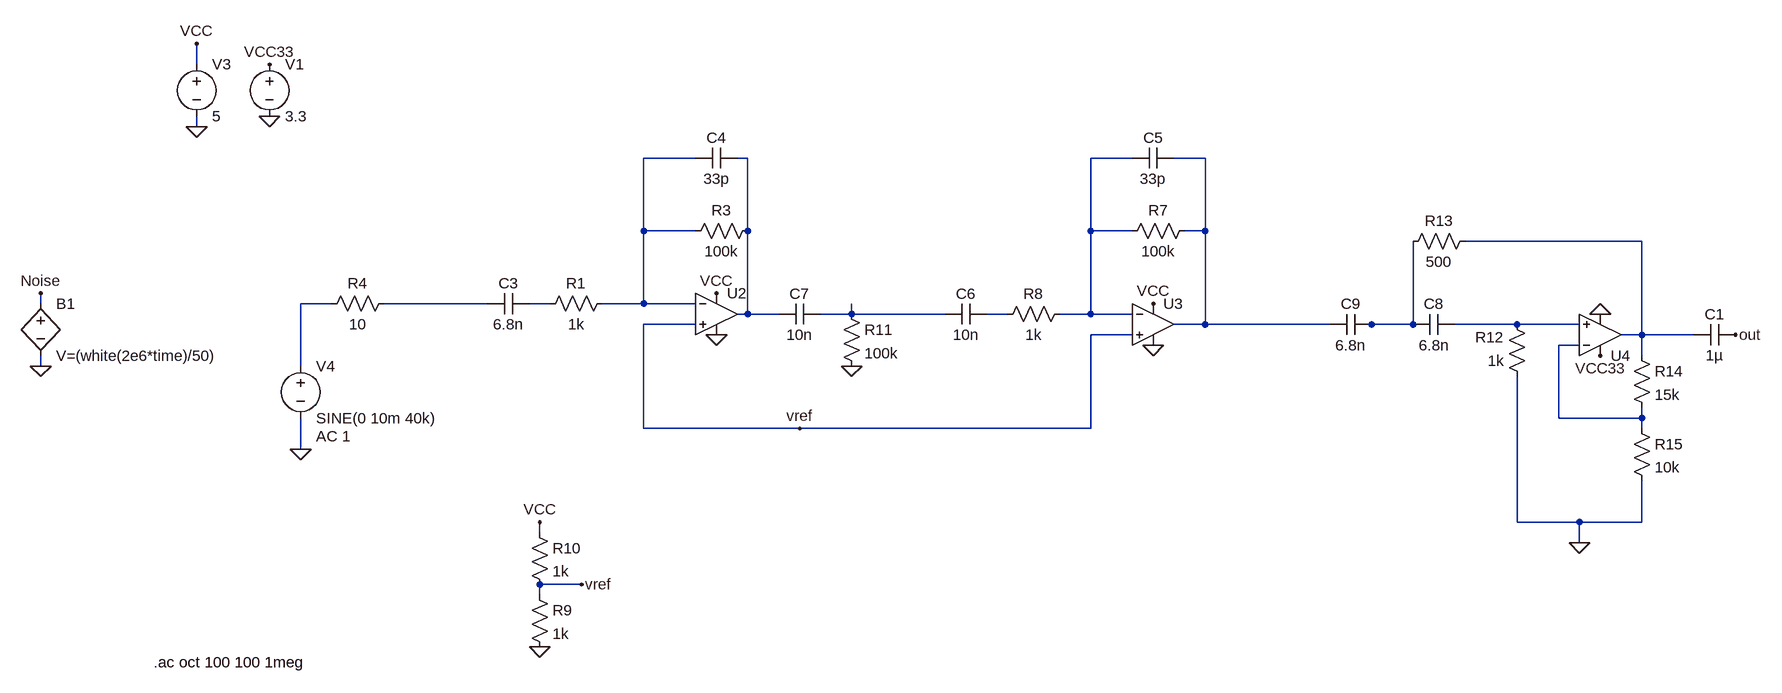
[diagram p0: schematic Draft2.asc]
Draft2.asc, the LTspice schematic file:
Version 4
SHEET 1 3704 680
WIRE 1280 -384 1280 -416
WIRE 1280 -288 1280 -304
WIRE 2048 -240 1968 -240
WIRE 2128 -240 2112 -240
WIRE 2720 -240 2656 -240
WIRE 2832 -240 2784 -240
WIRE 1968 -128 1968 -240
WIRE 2048 -128 1968 -128
WIRE 2128 -128 2128 -240
WIRE 2656 -128 2656 -240
WIRE 2720 -128 2656 -128
WIRE 2832 -128 2832 -240
WIRE 2832 -128 2800 -128
WIRE 3504 -112 3232 -112
WIRE 1040 -16 1040 -32
WIRE 1488 -16 1440 -16
WIRE 1728 -16 1568 -16
WIRE 1824 -16 1792 -16
WIRE 1968 -16 1968 -128
WIRE 1968 -16 1904 -16
WIRE 2048 -16 1968 -16
WIRE 2128 0 2128 -128
WIRE 2128 0 2112 0
WIRE 2176 0 2128 0
WIRE 2288 0 2288 -16
WIRE 2288 0 2240 0
WIRE 2432 0 2288 0
WIRE 2528 0 2496 0
WIRE 2656 0 2656 -128
WIRE 2656 0 2608 0
WIRE 2720 0 2656 0
WIRE 2048 16 1968 16
WIRE 2832 16 2832 -128
WIRE 2832 16 2784 16
WIRE 3024 16 2832 16
WIRE 3088 16 3072 16
WIRE 3152 16 3152 -112
WIRE 3152 16 3088 16
WIRE 3312 16 3216 16
WIRE 3408 16 3312 16
WIRE 2720 32 2656 32
WIRE 3504 32 3504 -112
WIRE 3504 32 3472 32
WIRE 3584 32 3504 32
WIRE 3408 48 3376 48
WIRE 3504 64 3504 32
WIRE 1040 80 1040 64
WIRE 1440 80 1440 -16
WIRE 3376 160 3376 48
WIRE 3504 160 3504 144
WIRE 3504 160 3376 160
WIRE 1968 176 1968 16
WIRE 2208 176 1968 176
WIRE 2656 176 2656 32
WIRE 2656 176 2208 176
WIRE 3504 176 3504 160
WIRE 1440 208 1440 160
WIRE 3312 320 3312 96
WIRE 3408 320 3312 320
WIRE 3504 320 3504 256
WIRE 3504 320 3408 320
WIRE 1808 336 1808 320
WIRE 3408 352 3408 320
WIRE 1872 416 1808 416
WIRE 1808 432 1808 416
FLAG 1280 -288 0
FLAG 1280 -416 VCC
FLAG 2080 -32 VCC
FLAG 2752 -16 VCC
FLAG 2080 32 0
FLAG 2752 48 0
FLAG 2208 176 vref
FLAG 1808 512 0
FLAG 1808 320 VCC
FLAG 1872 416 vref
FLAG 1440 208 0
FLAG 2288 80 0
FLAG 3440 0 0
FLAG 3408 352 0
FLAG 1392 -384 VCC33
FLAG 1392 -304 0
FLAG 3440 64 VCC33
FLAG 1040 80 0
FLAG 1040 -32 Noise
FLAG 3648 32 out
SYMBOL cap 1728 0 R270
WINDOW 0 32 32 VTop 2
WINDOW 3 0 32 VBottom 2
SYMATTR InstName C3
SYMATTR Value 6.8n
SYMBOL res 1920 -32 R90
WINDOW 0 0 56 VBottom 2
WINDOW 3 32 56 VTop 2
SYMATTR InstName R1
SYMATTR Value 1k
SYMBOL res 2144 -144 R90
WINDOW 0 0 56 VBottom 2
WINDOW 3 32 56 VTop 2
SYMATTR InstName R3
SYMATTR Value 100k
SYMBOL res 2816 -144 R90
WINDOW 0 0 56 VBottom 2
WINDOW 3 32 56 VTop 2
SYMATTR InstName R7
SYMATTR Value 100k
SYMBOL cap 2112 -256 R90
WINDOW 0 0 32 VBottom 2
WINDOW 3 32 32 VTop 2
SYMATTR InstName C4
SYMATTR Value 33p
SYMBOL cap 2784 -256 R90
WINDOW 0 0 32 VBottom 2
WINDOW 3 32 32 VTop 2
SYMATTR InstName C5
SYMATTR Value 33p
SYMBOL Opamps\\UniversalOpamp2 2080 0 R0
SYMATTR InstName U2
SYMBOL Opamps\\UniversalOpamp2 2752 16 R0
SYMATTR InstName U3
SYMBOL voltage 1280 -400 R0
WINDOW 123 0 0 Left 0
WINDOW 39 0 0 Left 0
SYMATTR InstName V3
SYMATTR Value 5
SYMBOL voltage 1440 64 R0
WINDOW 123 24 124 Left 2
WINDOW 39 0 0 Left 0
SYMATTR InstName V4
SYMATTR Value SINE(0 10m 40k)
SYMATTR Value2 AC 1
SYMBOL cap 2496 -16 R90
WINDOW 0 0 32 VBottom 2
WINDOW 3 32 32 VTop 2
SYMATTR InstName C6
SYMATTR Value 10n
SYMBOL res 2624 -16 R90
WINDOW 0 0 56 VBottom 2
WINDOW 3 32 56 VTop 2
SYMATTR InstName R8
SYMATTR Value 1k
SYMBOL res 1792 416 R0
SYMATTR InstName R9
SYMATTR Value 1k
SYMBOL res 1792 320 R0
SYMATTR InstName R10
SYMATTR Value 1k
SYMBOL cap 2176 16 R270
WINDOW 0 32 32 VTop 2
WINDOW 3 0 32 VBottom 2
SYMATTR InstName C7
SYMATTR Value 10n
SYMBOL res 2272 -16 R0
SYMATTR InstName R11
SYMATTR Value 100k
SYMBOL cap 3152 32 R270
WINDOW 0 32 32 VTop 2
WINDOW 3 0 32 VBottom 2
SYMATTR InstName C8
SYMATTR Value 6.8n
SYMBOL res 3328 112 R180
WINDOW 0 36 76 Left 2
WINDOW 3 36 40 Left 2
SYMATTR InstName R12
SYMATTR Value 1k
SYMBOL Opamps\\UniversalOpamp2 3440 32 M180
SYMATTR InstName U4
SYMBOL res 3248 -128 R90
WINDOW 0 0 56 VBottom 2
WINDOW 3 32 56 VTop 2
SYMATTR InstName R13
SYMATTR Value 500
SYMBOL res 3488 48 R0
SYMATTR InstName R14
SYMATTR Value 15k
SYMBOL res 3488 160 R0
SYMATTR InstName R15
SYMATTR Value 10k
SYMBOL cap 3024 32 R270
WINDOW 0 32 32 VTop 2
WINDOW 3 0 32 VBottom 2
SYMATTR InstName C9
SYMATTR Value 6.8n
SYMBOL voltage 1392 -400 R0
WINDOW 123 0 0 Left 0
WINDOW 39 0 0 Left 0
SYMATTR InstName V1
SYMATTR Value 3.3
SYMBOL bv 1040 -32 R0
SYMATTR InstName B1
SYMATTR Value V=(white(2e6*time)/50)
SYMBOL res 1584 -32 R90
WINDOW 0 0 56 VBottom 2
WINDOW 3 32 56 VTop 2
SYMATTR InstName R4
SYMATTR Value 10
SYMBOL cap 3648 16 R90
WINDOW 0 0 32 VBottom 2
WINDOW 3 32 32 VTop 2
SYMATTR InstName C1
SYMATTR Value 1µ
TEXT 1214 536 Left 2 !.ac oct 100 100 1meg

The netlist it stands for:
* Draft2.asc
C3 N007 N008 6.8n
R1 N001 N008 1k
R3 N002 N001 100k
R7 N004 N003 100k
C4 N002 N001 33p
C5 N004 N003 33p
XU2 vref N001 VCC 0 N002 level.2 Avol=1Meg GBW=10Meg Slew=10Meg ilimit=25m rail=0 Vos=0 phimargin=45 en=0 enk=0 in=0 ink=0 Rin=500Meg  ; pins IN+ IN- V+ V- OUT
XU3 vref N003 VCC 0 N004 level.2 Avol=1Meg GBW=10Meg Slew=10Meg ilimit=25m rail=0 Vos=0 phimargin=45 en=0 enk=0 in=0 ink=0 Rin=500Meg  ; pins IN+ IN- V+ V- OUT
V3 VCC 0 5
V4 N006 0 SINE(0 10m 40k) AC 1
C6 N010 N009 10n
R8 N003 N010 1k
R9 vref 0 1k
R10 VCC vref 1k
C7 N002 N009 10n
R11 N009 0 100k
C8 N011 N012 6.8n
R12 0 N012 1k
XU4 N012 N013 VCC33 0 N005 level.2 Avol=1Meg GBW=10Meg Slew=10Meg ilimit=25m rail=0 Vos=0 phimargin=45 en=0 enk=0 in=0 ink=0 Rin=500Meg  ; pins IN+ IN- V+ V- OUT
R13 N005 N011 500
R14 N005 N013 15k
R15 N013 0 10k
C9 N004 N011 6.8n
V1 VCC33 0 3.3
B1 Noise 0 V=(white(2e6*time)/50)
R4 N007 N006 10
C1 out N005 1µ
.ac oct 100 100 1meg
.lib UniversalOpamps2.sub
.backanno
.end